# EAGLE schematic teensy36-test-harness (EAGLE 7.7.0)
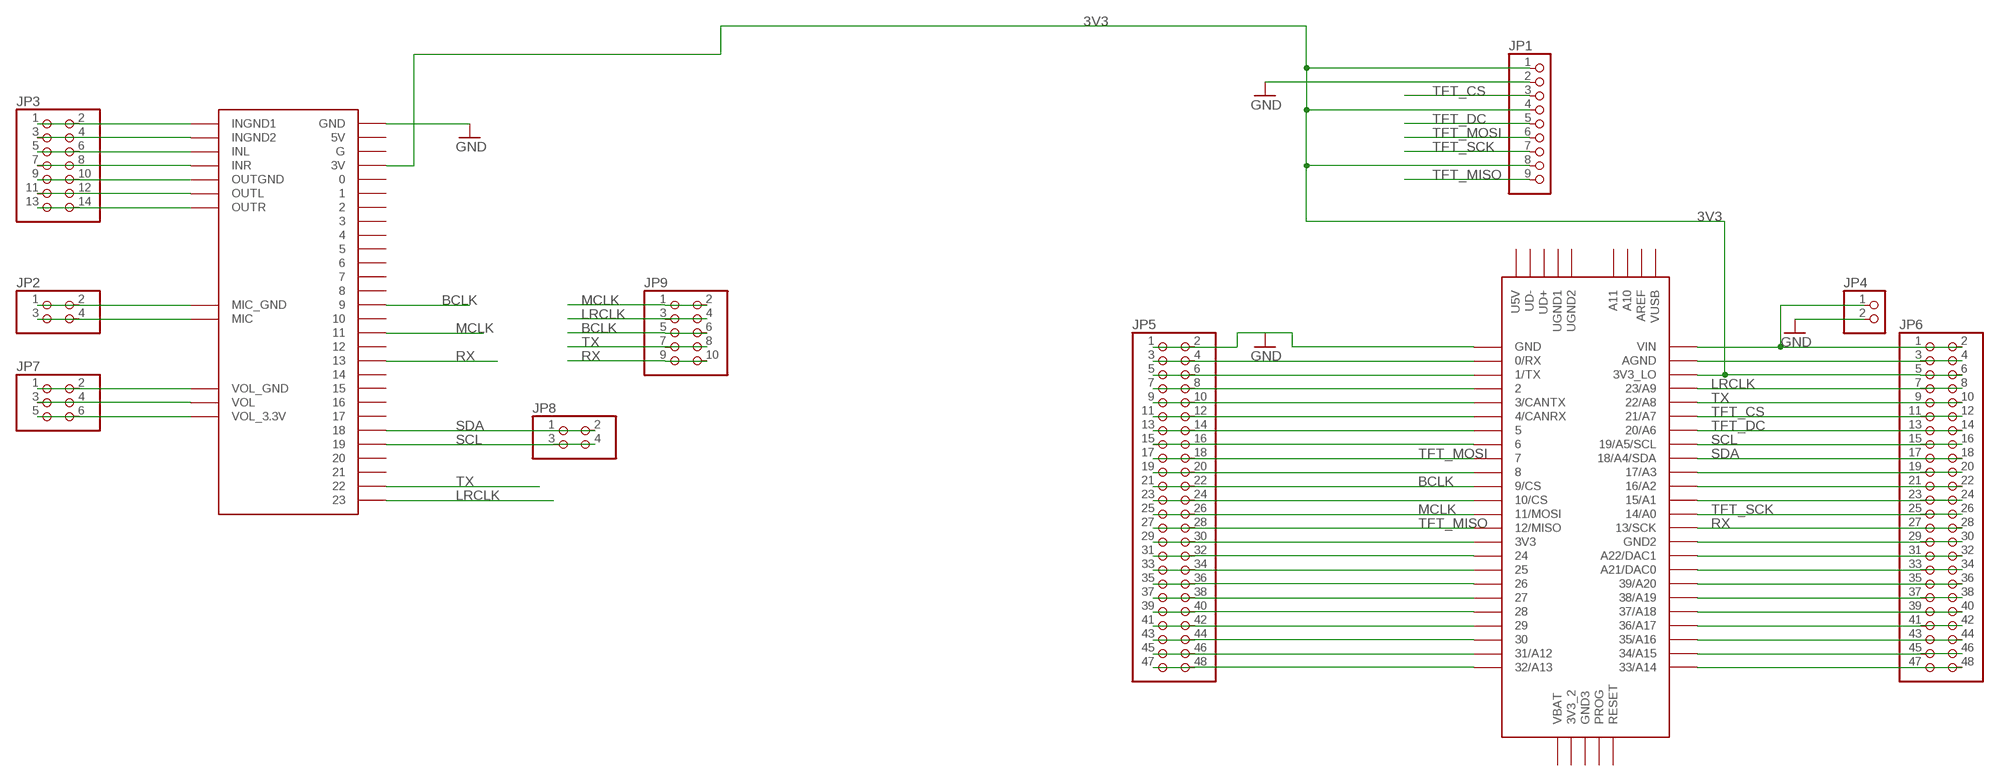
[diagram p0: schematic, sheet 1]

## Parts
JP1  PINHD-1X9  [1X09]
JP2  PINHD-2X2  [2X02]
JP3  PINHD-2X7  [2X07]
JP4  PINHD-1X2  [1X02]
JP5  PINHD-2X24  [2X24]
JP6  PINHD-2X24  [2X24]
JP7  PINHD-2X3  [2X03]
JP8  PINHD-2X2  [2X02]
JP9  PINHD-2X5  [2X05]
U$2  AUDIOSHIELD  [AUDIOSHIELD]
U$3  TEENSY_3.5/3.6  [TEENSY_3.5/3.6]

## Nets
3V3: JP1.1 JP1.4 JP1.8 JP6.5 JP6.6 U$2.3V U$3.3V3_LO
BCLK: JP5.21 JP5.22 JP9.5 JP9.6 U$2.9 U$3.9/CS
GND: JP1.2 JP4.2 JP5.1 JP5.2 U$2.GND U$3.GND
LRCLK: JP6.7 JP6.8 JP9.3 JP9.4 U$2.23 U$3.23/A9
MCLK: JP5.25 JP5.26 JP9.1 JP9.2 U$2.11 U$3.11/MOSI
N$1: JP2.1 JP2.2 U$2.GND_MIC(MIC_GND)
N$2: JP4.1 JP6.1 JP6.2 U$3.VIN
N$3: JP7.1 JP7.2 U$2.VOL_GND
N$4: JP5.3 JP5.4 U$3.0/RX
N$5: JP5.5 JP5.6 U$3.1/TX
N$6: JP5.7 JP5.8 U$3.2
N$7: JP5.9 JP5.10 U$3.3/CANTX
N$8: JP5.11 JP5.12 U$3.4/CANRX
N$9: JP5.13 JP5.14 U$3.5
N$10: JP2.3 JP2.4 U$2.MIC
N$11: JP3.1 JP3.2 U$2.INGND1
N$12: JP3.3 JP3.4 U$2.INGND2
N$13: JP3.5 JP3.6 U$2.INL
N$14: JP3.7 JP3.8 U$2.INR
N$15: JP3.9 JP3.10 U$2.OUTGND
N$16: JP3.11 JP3.12 U$2.OUTL
N$17: JP3.13 JP3.14 U$2.OUTR
N$18: JP5.15 JP5.16 U$3.6
N$19: JP7.3 JP7.4 U$2.VOL
N$20: JP5.19 JP5.20 U$3.8
N$21: JP7.5 JP7.6 U$2.VOL_3.3V
N$22: JP5.23 JP5.24 U$3.10/CS
N$25: JP5.29 JP5.30 U$3.3V3
N$26: JP5.31 JP5.32 U$3.24
N$27: JP5.33 JP5.34 U$3.25
N$28: JP5.35 JP5.36 U$3.26
N$29: JP5.37 JP5.38 U$3.27
N$30: JP5.39 JP5.40 U$3.28
N$31: JP5.41 JP5.42 U$3.29
N$32: JP5.43 JP5.44 U$3.30
N$33: JP5.45 JP5.46 U$3.31/A12
N$34: JP5.47 JP5.48 U$3.32/A13
N$36: JP6.3 JP6.4 U$3.AGND
N$44: JP6.19 JP6.20 U$3.17/A3
N$45: JP6.21 JP6.22 U$3.16/A2
N$46: JP6.23 JP6.24 U$3.15/A1
N$49: JP6.29 JP6.30 U$3.GND2
N$50: JP6.31 JP6.32 U$3.A22/DAC1
N$51: JP6.33 JP6.34 U$3.21/DAC0(A21/DAC0)
N$52: JP6.35 JP6.36 U$3.39/A20
N$53: JP6.37 JP6.38 U$3.38/A19
N$54: JP6.39 JP6.40 U$3.37/A18
N$55: JP6.41 JP6.42 U$3.36/A17
N$56: JP6.43 JP6.44 U$3.35/A16
N$57: JP6.45 JP6.46 U$3.34/A15
N$58: JP6.47 JP6.48 U$3.33/A14
RX: JP6.27 JP6.28 JP9.9 JP9.10 U$2.13 U$3.13/SCK
SCL: JP6.15 JP6.16 JP8.3 JP8.4 U$2.19 U$3.19/A5/SCL
SDA: JP6.17 JP6.18 JP8.1 JP8.2 U$2.18 U$3.18/A4/SDA
TFT_CS: JP1.3 JP6.11 JP6.12 U$3.21/A7
TFT_DC: JP1.5 JP6.13 JP6.14 U$3.20/A6
TFT_MISO: JP1.9 JP5.27 JP5.28
TFT_MOSI: JP1.6 JP5.17 JP5.18 U$3.7
TFT_SCK: JP1.7 JP6.25 JP6.26 U$3.14/A0
TX: JP6.9 JP6.10 JP9.7 JP9.8 U$2.22 U$3.22/A8
Unconnected: U$2.0 U$2.1 U$2.2 U$2.3 U$2.4 U$2.5 U$2.5V U$2.6 U$2.7 U$2.8 U$2.10 U$2.12 U$2.14 U$2.15 U$2.16 U$2.17 U$2.20 U$2.21 U$2.G U$3.3V3_2 U$3.12/MISO U$3.A10 U$3.A11 U$3.AREF U$3.GND3 U$3.PROG U$3.RESET U$3.U5V U$3.UD+ U$3.UD- U$3.UGND1 U$3.UGND2 U$3.VBAT U$3.VUSB

## Library data of the parts
JP1 = pinhead:PINHD-1X9: PIN HEADER
JP2 JP8 = pinhead:PINHD-2X2: PIN HEADER
JP3 = pinhead:PINHD-2X7: PIN HEADER
JP4 = pinhead:PINHD-1X2: PIN HEADER
JP5 JP6 = pinhead:PINHD-2X24: PIN HEADER
JP7 = pinhead:PINHD-2X3: PIN HEADER
JP9 = pinhead:PINHD-2X5: PIN HEADER
U$2 = Teensy_Audioshield:AUDIOSHIELD: Teensy 3 Audioshield by PJRC.COM
U$3 = JC_Teensy356:TEENSY_3.5/3.6